# EAGLE design 006P-5VSupply-TLV1117 (EAGLE 7.2.0)
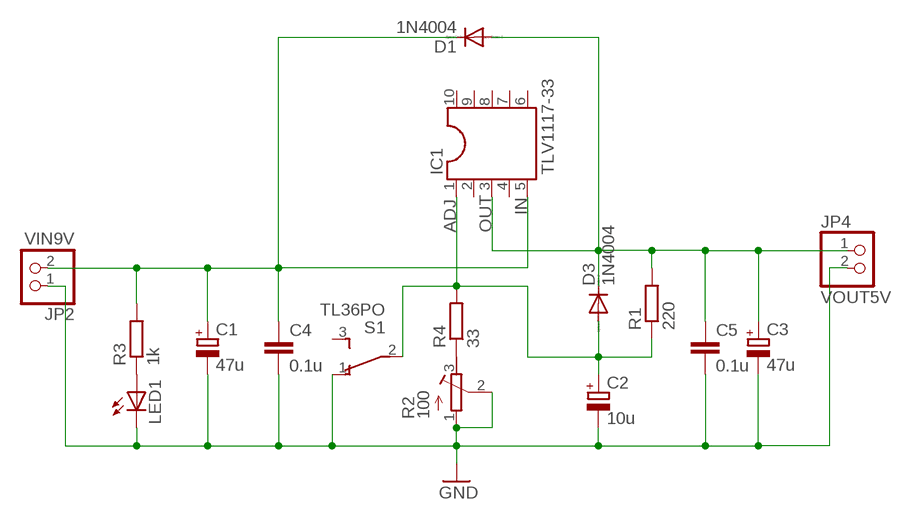
[diagram p0: schematic, sheet 1]

## Parts
C1  47u  CPOL-EUE2-4  [E2-4]
C2  10u  CPOL-EUE2-4  [E2-4]
C3  47u  CPOL-EUE2-4  [E2-4]
C4  0.1u  C-EU025-024X044  [C025-024X044]
C5  0.1u  C-EU025-024X044  [C025-024X044]
D1  1N4004  [DO41-10]
D3  1N4004  [DO41-10]
IC1  TLV1117-33  DIL10  [DIL10]
JP2  VIN9V  PINHD-1X2  [1X02]
JP4  VOUT5V  PINHD-1X2  [1X02]
LED1  LED3MM  [LED3MM]
R1  220  R-EU_0207/7  [0207/7]
R2  100  R-TRIMM3339P  [RTRIM3339P]
R3  1k  R-EU_0207/7  [0207/7]
R4  33  R-EU_0207/7  [0207/7]
S1  TL36PO  [TL3XPO]

## Nets
ADJ: C2.+ D3.A IC1.1 R1.1 R4.2 S1.2(P)
GND: C1.- C2.- C3.- C4.2 C5.2 JP2.1 JP4.2 LED1.K(C) R2.1(A) R2.2(S) S1.1(O)
IN: C1.+ C4.1 D1.C IC1.5 JP2.2 R3.2
N$2: R2.3(E) R4.1
N$6: LED1.A R3.1
OUT: C3.+ C5.1 D1.A D3.C IC1.3 JP4.1 R1.2
Unconnected: IC1.2 IC1.4 IC1.6 IC1.7 IC1.8 IC1.9 IC1.10 S1.3(S)

## Library data of the parts
C1-C3 = rcl:CPOL-EU: POLARIZED CAPACITOR, European symbol
C4 C5 = rcl:C-EU: CAPACITOR, European symbol
D1 D3 = diode:1N4004: DIODE general purpose rectifier, 1 A
IC1 = ic-package:DIL10: Dual In Line / Socket
JP2 JP4 = pinhead:PINHD-1X2: PIN HEADER
LED1 = led:LED: LED OSRAM: - CHIPLED LG R971, LG N971, LY N971, LG Q971, LY Q971, LO R971, LY R971 LH N974, LH R974 LS Q976, LO Q976, LY Q976 LO Q996 - Hyper CHIPLED LW Q18S LB Q993, LB Q99A, LB R99A - SideLED LS A670, LO A670, LY A670, LG A670, LP A670 LB A673, LV A673, LT A673, LW A673 LH A674 LY A675 LS A676, LA A676, LO A676, LY A676, LW A676 LS A679, LY A679, LG A679 - Hyper Micro SIDELED® LS Y876, LA Y876, LO Y876, LY Y876 LT Y87S - SmartLED LW L88C, LW L88S LB L89C, LB L89S, LG L890 LS L89K, LO L89K, LY L89K LS L896, LA L896, LO L896, LY L896 - TOPLED LS T670, LO T670, LY T670, LG T670, LP T670 LSG T670, LSP T670, LSY T670, LOP T670, LYG T670 LG T671, LOG T671, LSG T671 LB T673, LV T673, LT T673, LW T673 LH T674 LS T676, LA T676, LO T676, LY T676, LB T676, LH T676, LSB T676, LW T676 LB T67C, LV T67C, LT T67C, LS T67K, LO T67K, LY T67K, LW E67C LS E67B, LA E67B, LO E67B, LY E67B, LB E67C, LV E67C, LT E67C LW T67C LS T679, LY T679, LG T679 LS T770, LO T770, LY T770, LG T770, LP T770 LB T773, LV T773, LT T773, LW T773 LH T774 LS E675, LA E675, LY E675, LS T675 LS T776, LA T776, LO T776, LY T776, LB T776 LHGB T686 LT T68C, LB T68C - Hyper Mini TOPLED® LB M676 - Mini TOPLED Santana® LG M470 LS M47K, LO M47K, LY M47K Source: http://www.osram.convergy.de LUXEON: - LUMILED® LXK2-PW12-R00, LXK2-PW12-S00, LXK2-PW14-U00, LXK2-PW14-V00 LXK2-PM12-R00, LXK2-PM12-S00, LXK2-PM14-U00 LXK2-PE12-Q00, LXK2-PE12-R00, LXK2-PE12-S00, LXK2-PE14-T00, LXK2-PE14-U00 LXK2-PB12-K00, LXK2-PB12-L00, LXK2-PB12-M00, LXK2-PB14-N00, LXK2-PB14-P00, LXK2-PB14-Q00 LXK2-PR12-L00, LXK2-PR12-M00, LXK2-PR14-Q00, LXK2-PR14-R00 LXK2-PD12-Q00, LXK2-PD12-R00, LXK2-PD12-S00 LXK2-PH12-R00, LXK2-PH12-S00 LXK2-PL12-P00, LXK2-PL12-Q00, LXK2-PL12-R00 Source: www.luxeon.com KINGBRIGHT: KA-3528ASYC Source: www.kingbright.com
R1 R3 R4 = rcl:R-EU_: RESISTOR, European symbol
R2 = rcl:R-TRIMM: Trimm resistor
S1 = switch:TL36PO: TINY SWITCH ON - ON Source: http://www2.produktinfo.conrad.com/datenblaetter/700000-724999/705152-da-01-de-Subminiaturschalter_TL_36YO.pdf

## Board
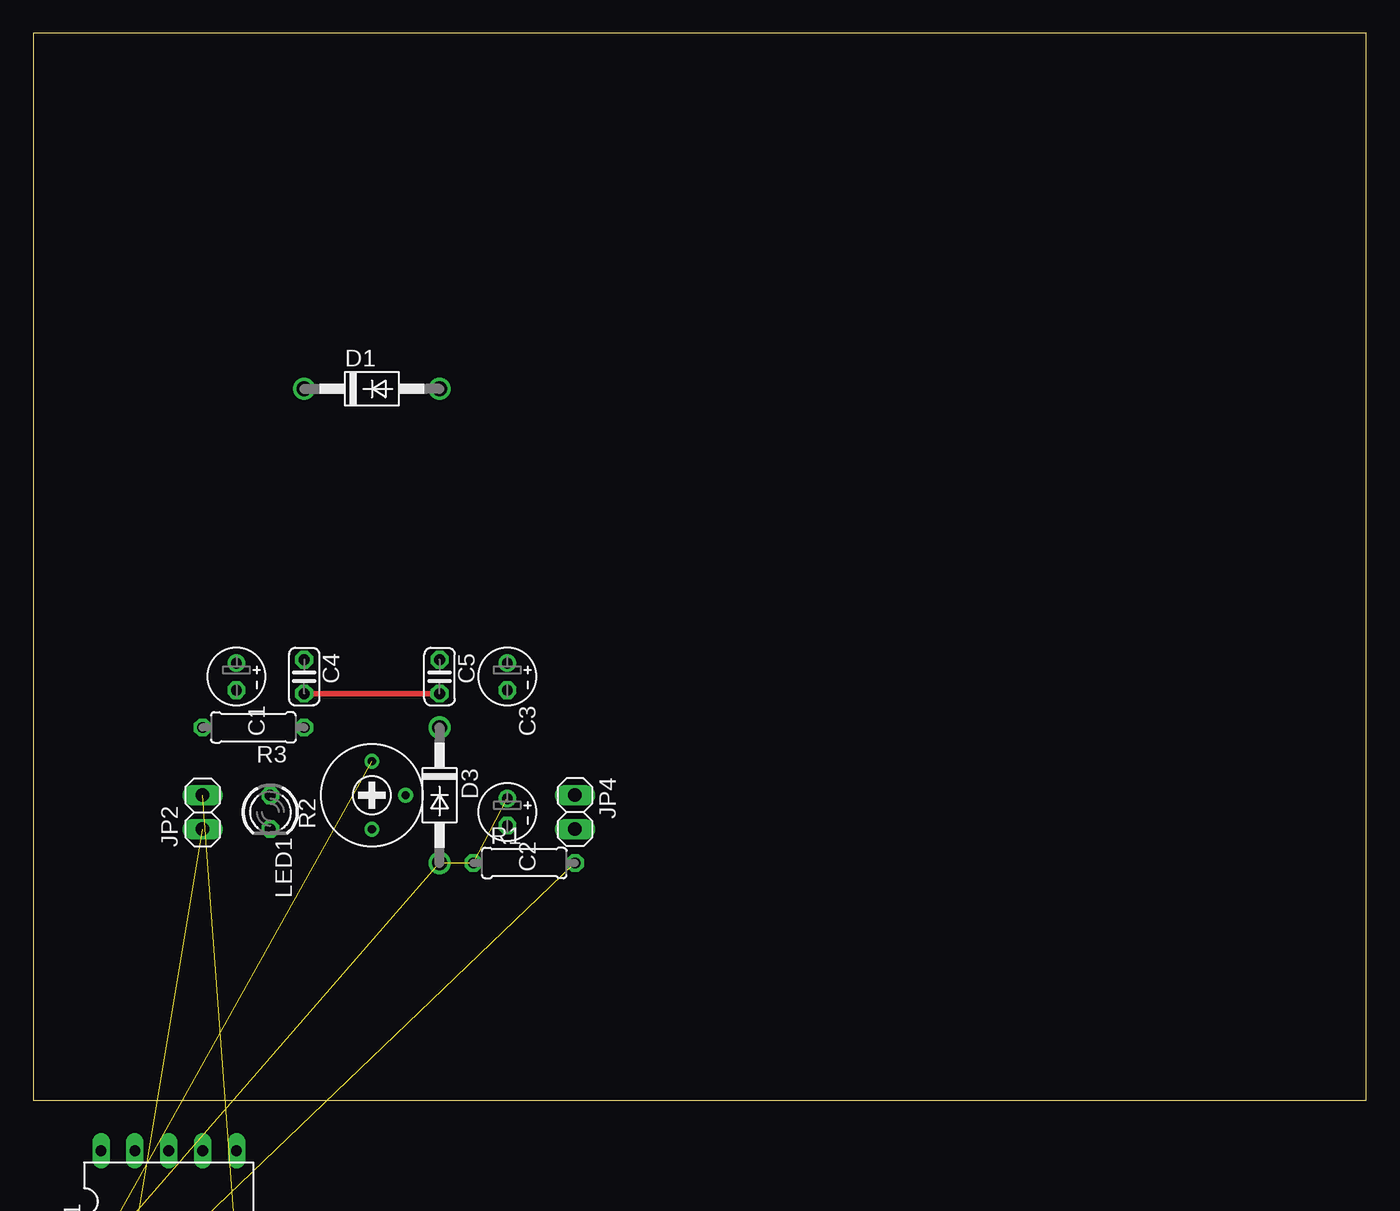
[diagram p1: board, top side]
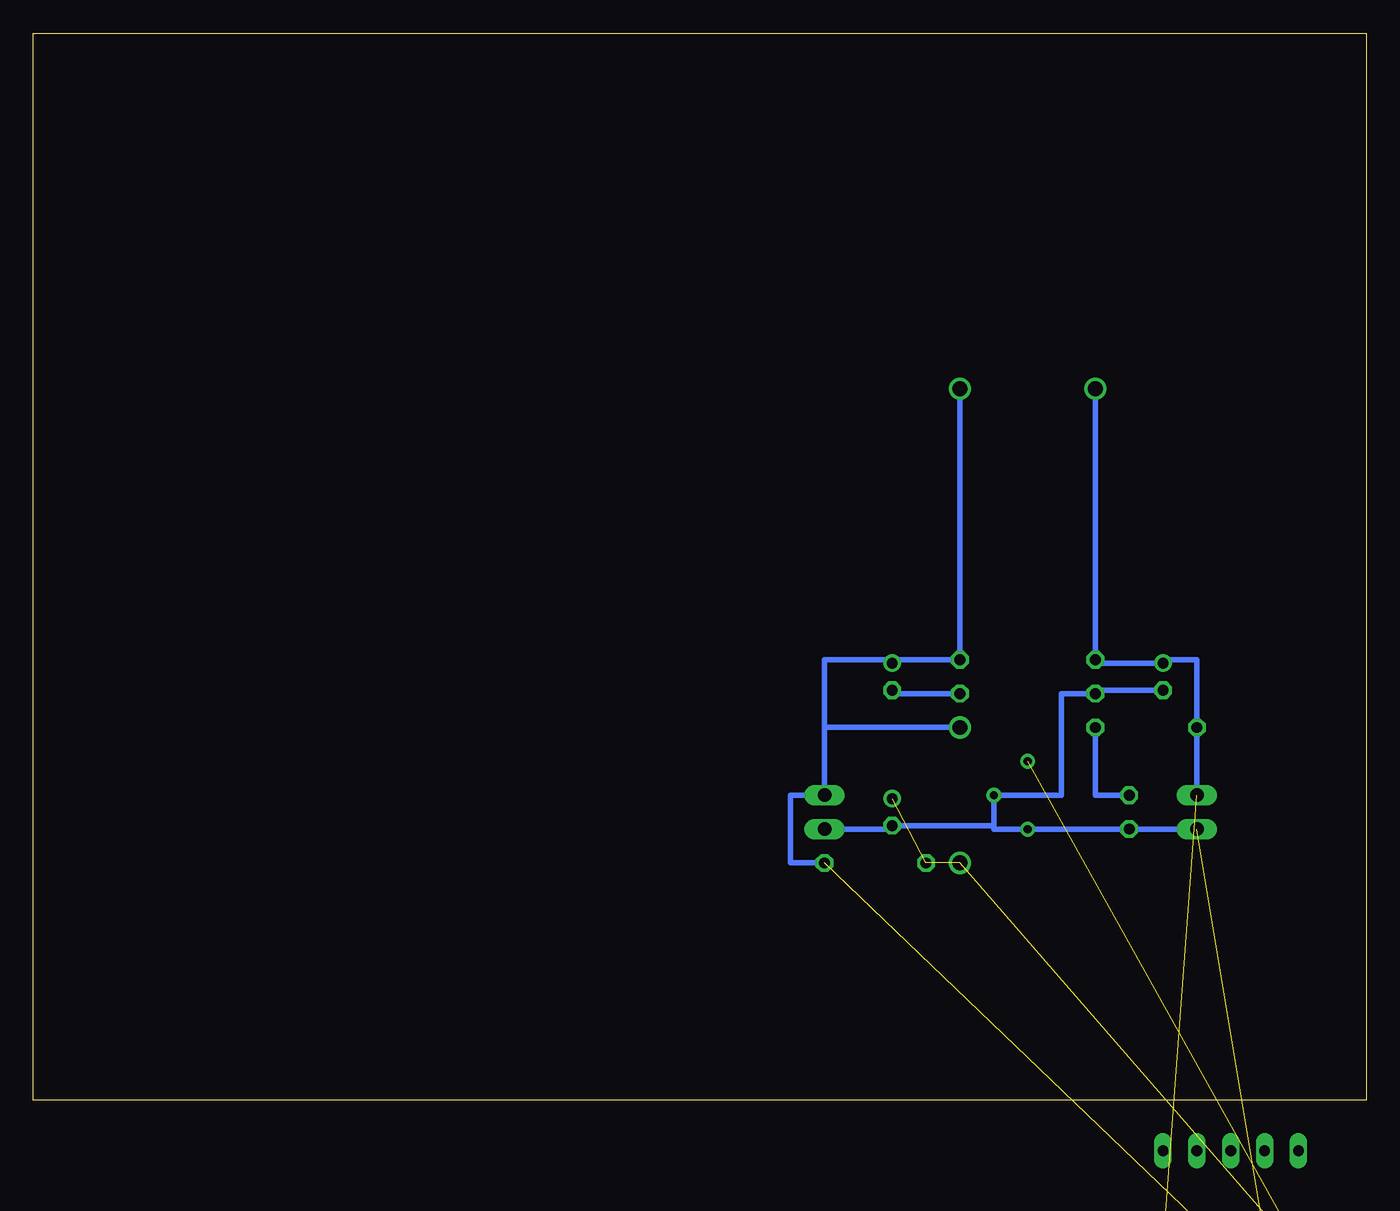
[diagram p2: board, bottom side, seen from below]

Size 100 x 80 mm. Coordinates in mm from the lower left corner, seen from the top.
Outline: 0,0 100,0 100,80 0,80 0,0
Copper layers (1*16): Top 0.035mm / dielectric 1.5mm / Bottom 0.035mm
Design rules "default": minimum track width 10mil, minimum drill 24mil, track to track 8mil, track to pad 8mil, pad to pad 8mil, via to via 8mil, smd to smd 8mil, copper to edge 40mil, drill to drill 8mil, minimum pad ring 10mil, minimum via ring 8mil, stop-mask expansion 4mil, vias tented up to drill 0mil, thermal gap 10mil

### Footprints (pad centres in the part's own frame; a part is rotated, then mirrored left to right if it is on the bottom)
E2-4 = drill 0.813 pad 1.27: + -1.016,0 | drill 0.813 pad 1.27 octagon: - 1.016,0
C025-024X044 = drill 0.813 octagon: 1 -1.27,0; 2 1.27,0
DO41-10 = drill 1.118: A 5.08,0; C -5.08,0
DIL10 = drill 0.813 long: 1 -5.08,-3.81; 2 -2.54,-3.81; 3 0,-3.81; 4 2.54,-3.81; 5 5.08,-3.81; 6 5.08,3.81; 7 2.54,3.81; 8 0,3.81; 9 -2.54,3.81; 10 -5.08,3.81
1X02 = drill 1.016 long: 1 -1.27,0; 2 1.27,0
LED3MM = drill 0.813 octagon: A -1.27,0; K 1.27,0
0207/7 = drill 0.813 octagon: 1 -3.81,0; 2 3.81,0
RTRIM3339P = drill 0.61: 1 -2.54,0; 2 0,-2.54; 3 2.54,0
TL3XPO = drill 1.1 pad 1.422 long: 1 -2.54,0; 2 0,0; 3 2.54,0

### Placement (x,y rotation side)
C1  15.24,31.75 270 top
C2  35.56,21.59 270 top
C3  35.56,31.75 270 top
C4  20.32,31.75 270 top
C5  30.48,31.75 270 top
D1  25.4,53.34 0 top
D3  30.48,22.86 270 top
IC1  10.16,-7.62 0 top  (outside the outline)
JP2  12.7,21.59 90 top
JP4  40.64,21.59 270 top
LED1  17.78,21.59 270 top
R1  36.83,17.78 0 top
R2  25.4,22.86 90 top
R3  16.51,27.94 180 top
R4  5.08,-17.78 0 top  (outside the outline)
S1  7.62,-25.4 0 top  (outside the outline)

### Tracks (layer width: path | path; a pad name or v marks a point on that pad's centre or on a via)
ADJ  (5 unrouted)
GND  (1 unrouted)
  Top 0.406: C5.2 C4.2
  Bottom 0.406: JP2.1 LED1.K R2.1 27.94,20.32 27.94,20.57 | 27.94,20.57 R2.2 22.86,22.86 22.86,30.48 C4.2 20.32,30.73 C1.- | 27.94,20.57 C2.- 35.56,20.32 JP4.2 40.64,20.57 | C5.2 35.56,30.48 C3.-
IN  (1 unrouted)
  Bottom 0.406: JP2.2 R3.2 12.7,33.02 15.24,33.02 C1.+ 20.32,32.77 C4.1 D1.C
N$2  (1 unrouted)
N$6
  Bottom 0.406: R3.1 20.32,22.86 LED1.A
OUT  (1 unrouted)
  Bottom 0.406: 35.56,33.02 C5.1 D1.A | 40.64,27.94 JP4.1 43.18,22.86 43.18,17.78 R1.2 | 40.64,27.94 40.64,33.02 35.56,33.02 | 35.56,33.02 C3.+ | D3.C 40.64,27.94